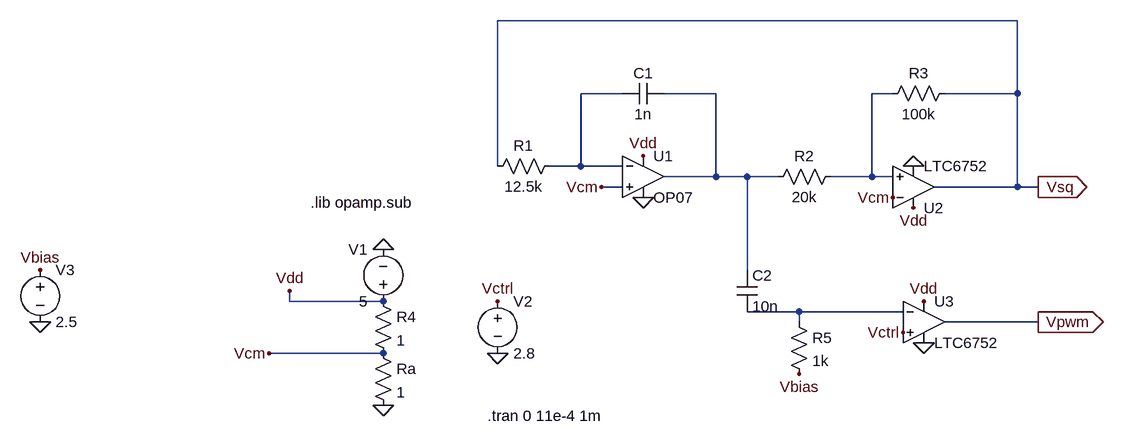
[diagram p0: schematic EE2019_Exp1.asc]
EE2019_Exp1.asc, the LTspice schematic file:
Version 4
SHEET 1 1204 680
WIRE 1040 -240 240 -240
WIRE 432 -128 368 -128
WIRE 576 -128 496 -128
WIRE 848 -128 816 -128
WIRE 1040 -128 1040 -240
WIRE 1040 -128 928 -128
WIRE 240 -16 240 -240
WIRE 368 -16 368 -128
WIRE 368 -16 320 -16
WIRE 432 -16 368 -16
WIRE 576 0 576 -128
WIRE 576 0 496 0
WIRE 624 0 576 0
WIRE 672 0 624 0
WIRE 816 0 816 -128
WIRE 816 0 752 0
WIRE 848 0 816 0
WIRE 432 16 400 16
WIRE 1040 16 1040 -128
WIRE 1040 16 912 16
WIRE 1072 16 1040 16
WIRE 624 144 624 0
WIRE -80 192 -80 176
WIRE 64 192 -80 192
WIRE 704 208 624 208
WIRE 864 208 704 208
WIRE 704 224 704 208
WIRE 1072 224 928 224
WIRE 64 272 -112 272
FLAG 240 272 0
FLAG 240 192 Vctrl
FLAG 64 112 0
FLAG 64 352 0
FLAG -80 176 Vdd
FLAG -112 272 Vcm
FLAG 400 16 Vcm
FLAG 1072 16 Vsq
IOPIN 1072 16 Out
FLAG 464 -32 Vdd
FLAG 880 48 Vdd
FLAG 896 192 Vdd
FLAG 464 32 0
FLAG 880 -16 0
FLAG 896 256 0
FLAG 1072 224 Vpwm
IOPIN 1072 224 Out
FLAG 848 32 Vcm
FLAG 864 240 Vctrl
FLAG 704 304 Vbias
FLAG -464 224 0
FLAG -464 144 Vbias
SYMBOL voltage 240 176 R0
WINDOW 123 0 0 Left 0
WINDOW 39 0 0 Left 0
SYMATTR InstName V2
SYMATTR Value 2.8
SYMBOL res 48 256 R0
SYMATTR InstName Ra
SYMATTR Value 1
SYMBOL res 48 176 R0
SYMATTR InstName R4
SYMATTR Value 1
SYMBOL voltage 64 208 R180
WINDOW 0 24 96 Left 2
WINDOW 3 24 16 Left 2
SYMATTR InstName V1
SYMATTR Value 5
SYMBOL OpAmps\\OP07 464 -64 R0
SYMATTR InstName U1
SYMBOL res 336 -32 R90
WINDOW 0 0 56 VBottom 2
WINDOW 3 32 56 VTop 2
SYMATTR InstName R1
SYMATTR Value 12.5k
SYMBOL cap 496 -144 R90
WINDOW 0 0 32 VBottom 2
WINDOW 3 32 32 VTop 2
SYMATTR InstName C1
SYMATTR Value 1n
SYMBOL res 768 -16 R90
WINDOW 0 0 56 VBottom 2
WINDOW 3 32 56 VTop 2
SYMATTR InstName R2
SYMATTR Value 20k
SYMBOL res 944 -144 R90
WINDOW 0 0 56 VBottom 2
WINDOW 3 32 56 VTop 2
SYMATTR InstName R3
SYMATTR Value 100k
SYMBOL Comparators\\LTC6752 880 80 M180
SYMATTR InstName U2
SYMBOL Comparators\\LTC6752 896 160 R0
SYMATTR InstName U3
SYMBOL cap 608 144 R0
SYMATTR InstName C2
SYMATTR Value 10n
SYMBOL res 688 208 R0
SYMATTR InstName R5
SYMATTR Value 1k
SYMBOL voltage -464 128 R0
WINDOW 123 0 0 Left 0
WINDOW 39 0 0 Left 0
SYMATTR InstName V3
SYMATTR Value 2.5
TEXT -48 40 Left 2 !.lib opamp.sub
TEXT 224 368 Left 2 !.tran 0 11e-4 1m

The netlist it stands for:
* EE2019_Exp1.asc
V2 Vctrl 0 2.8
Ra Vcm 0 1
R4 Vdd Vcm 1
V1 Vdd 0 5
XU1 Vcm N001 Vdd 0 N002 LT1001  ; OP07, pins In+ In- V+ V- OUT
R1 N001 Vsq 12.5k
C1 N002 N001 1n
R2 N003 N002 20k
R3 Vsq N003 100k
XU2 N003 Vcm Vdd 0 Vsq LTC6752  ; pins In+ In- V+ V- OUT
XU3 Vctrl N004 Vdd 0 Vpwm LTC6752  ; pins In+ In- V+ V- OUT
C2 N002 N004 10n
R5 N004 Vbias 1k
V3 Vbias 0 2.5
.lib opamp.sub
.tran 0 11e-4 1m
.lib LTC.lib
.lib LTC7.lib
.backanno
.end